# EAGLE design main (EAGLE 9.5.2)
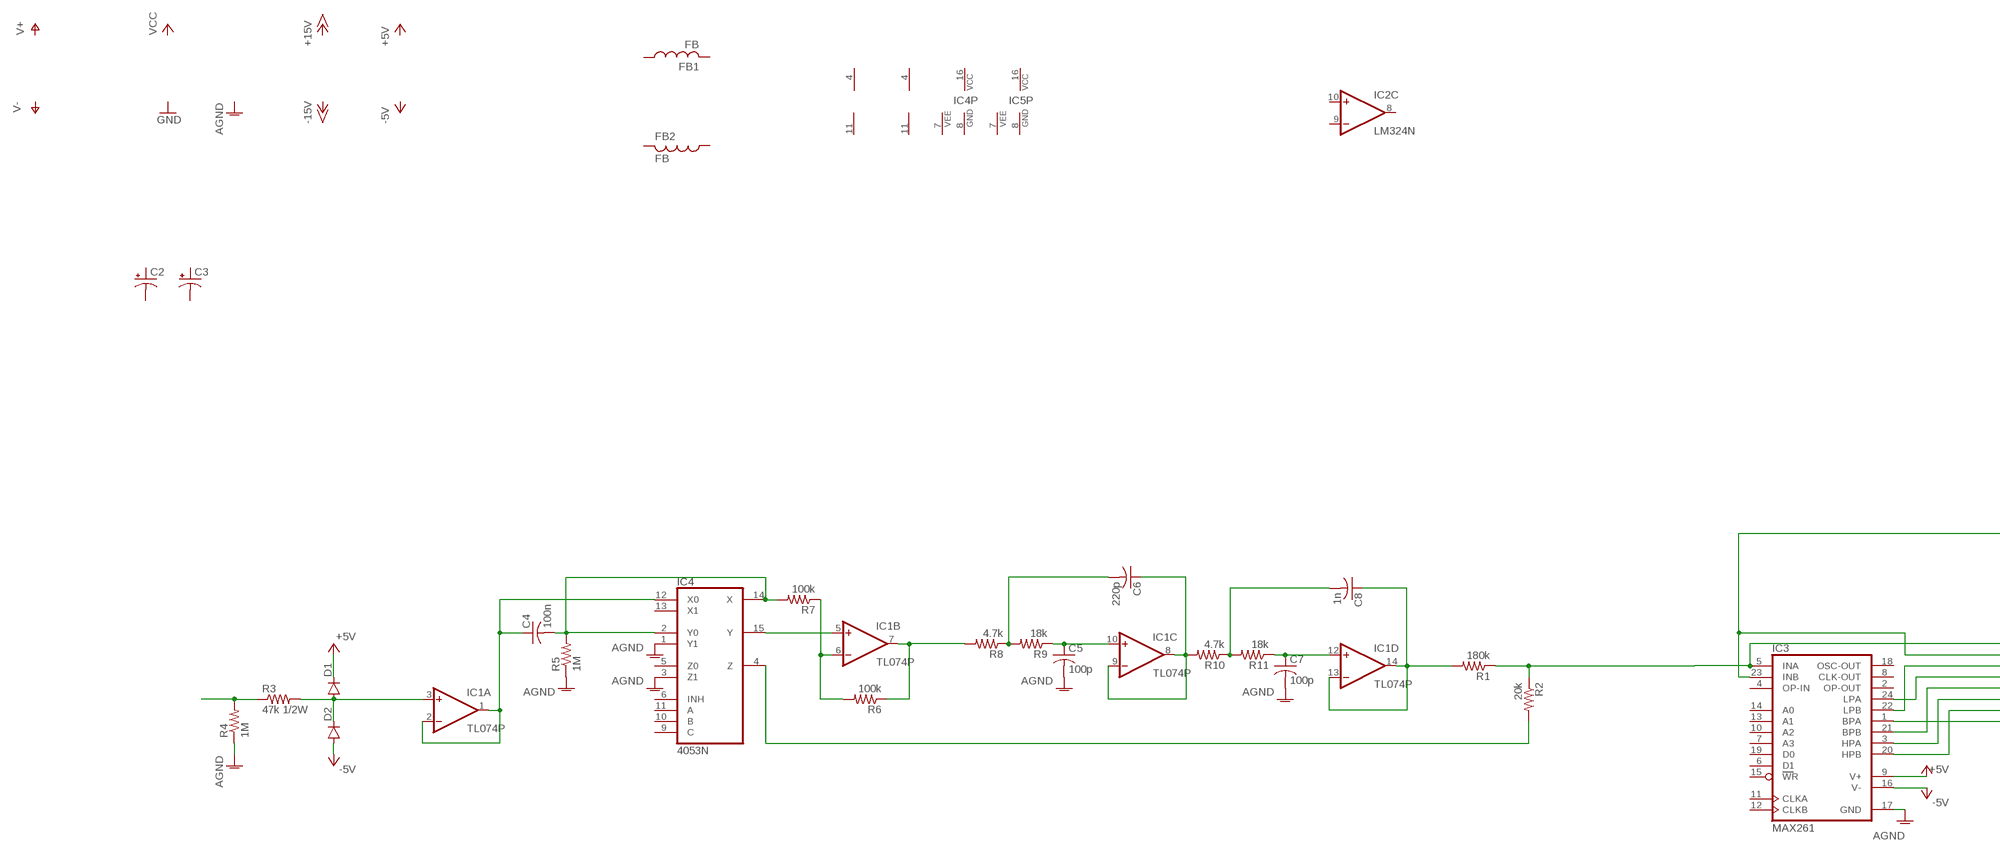
[diagram p0: schematic, sheet 1, part 1 of 2]
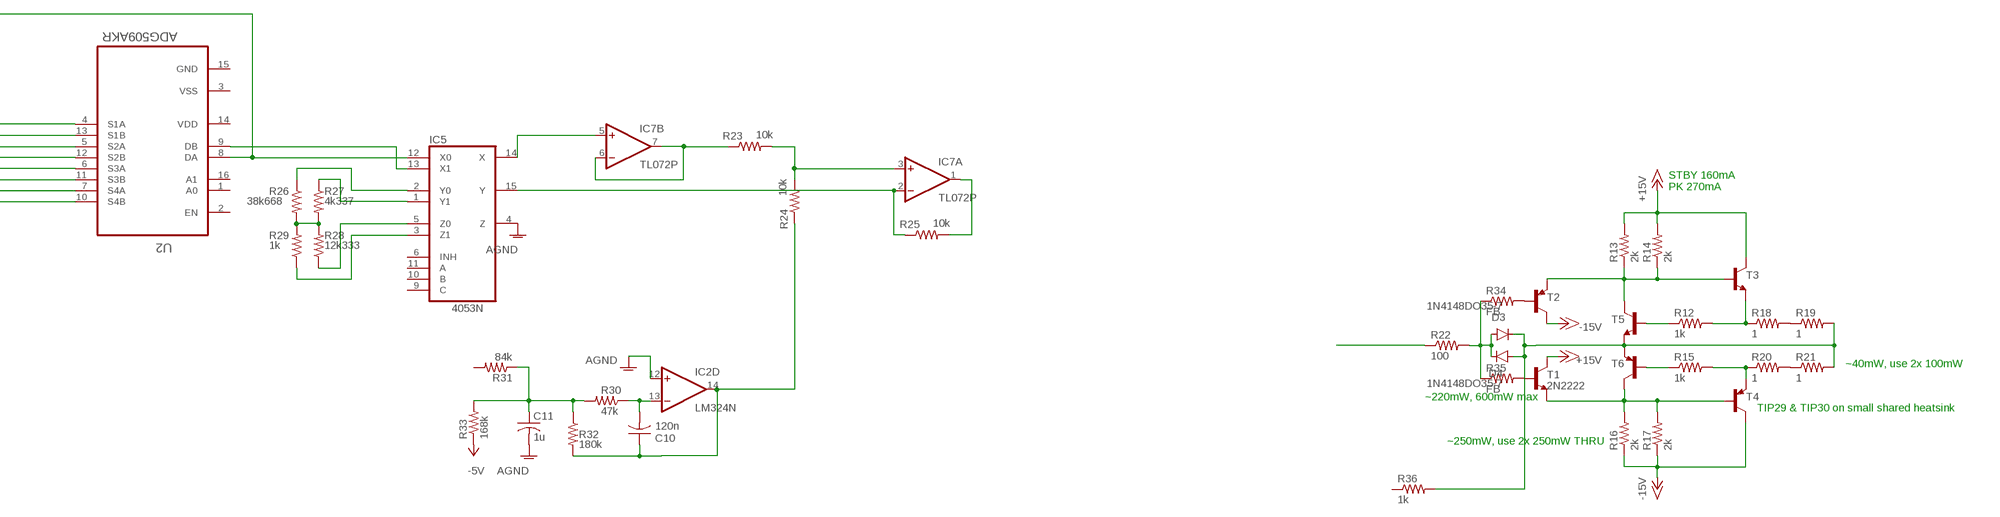
[diagram p1: schematic, sheet 1, part 2 of 2]

## Parts
C2  CPOL-USC/6032-28R  [C/6032-28R]
C3  CPOL-USE2.5-6  [E2,5-6]
C4  100n  C-USC0603  [C0603]
C5  100p  C-USC0603  [C0603]
C6  220p  C-USC0603  [C0603]
C7  100p  C-USC0603  [C0603]
C8  1n  C-USC0603  [C0603]
C10  120n  C-USC0603  [C0603]
C11  1u  C-USC0603  [C0603]
D1  1N4148DO35-10  [DO35-10]
D2  1N4148DO35-10  [DO35-10]
D3  1N4148DO35-7  [DO35-7]
D4  1N4148DO35-7  [DO35-7]
FB1  FB  [FB]
FB2  FB  [FB]
IC1  TL074P  [DIL14]
IC2  LM324N  [DIL14]
IC3  MAX261  [DIL24-3]
IC4  4053N  [DIL16]
IC5  4053N  [DIL16]
IC7  TL072P  [DIL08]
R1  180k  R-US_R0603  [R0603]
R2  20k  R-US_R0603  [R0603]
R3  47k 1/2W  R-US_0207/10  [0207/10]
R4  1M  R-US_0207/10  [0207/10]
R5  1M  R-US_R0603  [R0603]
R6  100k  R-US_R0603  [R0603]
R7  100k  R-US_R0603  [R0603]
R8  4.7k  R-US_R0603  [R0603]
R9  18k  R-US_R0603  [R0603]
R10  4.7k  R-US_R0603  [R0603]
R11  18k  R-US_R0603  [R0603]
R12  1k  R-US_0207/7  [0207/7]
R13  2k  R-US_0207/2V  [0207/2V]
R14  2k  R-US_0207/2V  [0207/2V]
R15  1k  R-US_0207/7  [0207/7]
R16  2k  R-US_0207/2V  [0207/2V]
R17  2k  R-US_0207/2V  [0207/2V]
R18  1  R-US_R0805  [R0805]
R19  1  R-US_R0805  [R0805]
R20  1  R-US_R0805  [R0805]
R21  1  R-US_R0805  [R0805]
R22  100  R-US_0207/7  [0207/7]
R23  10k  R-US_R0603  [R0603]
R24  10k  R-US_R0603  [R0603]
R25  10k  R-US_R0603  [R0603]
R26  38k668  R-US_R0603  [R0603]
R27  4k337  R-US_R0603  [R0603]
R28  12k333  R-US_R0603  [R0603]
R29  1k  R-US_R0603  [R0603]
R30  47k  R-US_R0603  [R0603]
R31  84k  R-US_R0603  [R0603]
R32  180k  R-US_R0603  [R0603]
R33  168k  R-US_R0603  [R0603]
R34  FB  R-US_0207/7  [0207/7]
R35  FB  R-US_0207/7  [0207/7]
R36  1k  R-US_0207/7  [0207/7]
T1  2N2222  [TO92-EBC-OVAL]
T2  BC557A-PNP-TO92-EBC  [TO92-EBC]
T3  -NPN-TO220V  [TO220V]
T4  -PNP-TO220V  [TO220V]
T5  MMBT3904LT1-NPN-SOT23-BEC  [SOT23-BEC]
T6  MMBT3906LT1-PNP-SOT23-BEC  [SOT23-BEC]
U2  ADG509AKR  [SOIC127P600X175-16N]

## Nets
+5V: D1.C IC3.9(V+)
+15V: R13.2 R14.2 T1.C T3.2(C)
-5V: D2.A IC3.16(V-) R33.1
-15V: R16.1 R17.1 T2.C T4.2(C)
AGND: C5.2 C7.2 C11.2 IC2.12(D:+IN) IC3.17(GND) IC4.1(Y1) IC4.3(Z1) IC5.4(Z) R4.1 R5.1
N$1: D1.A D2.C IC1.3(A:+IN) R3.2
N$2: IC3.24(LPA) U2.12(S2B)
N$3: R3.1 R4.2
N$4: IC1.5(B:+IN) IC4.15(Y)
N$5: IC1.6(B:-IN) R6.2 R7.1
N$6: C4.2 IC4.2(Y0) IC4.14(X) R5.2 R7.2
N$7: C6.1 IC1.8(C:OUT) IC1.9(C:-IN) R10.2
N$8: IC1.7(B:OUT) R6.1 R8.2
N$9: C6.2 R8.1 R9.2
N$10: C5.1 IC1.10(C:+IN) R9.1
N$11: C8.1 IC1.13(D:-IN) IC1.14(D:OUT) R1.2
N$12: IC5.14(X) IC7.5(B:+IN)
N$13: C8.2 R10.1 R11.2
N$14: C7.1 IC1.12(D:+IN) R11.1
N$15: IC3.3(HPA) U2.11(S3B)
N$16: IC3.1(BPA) U2.10(S4B)
N$17: C4.1 IC1.1(A:OUT) IC1.2(A:-IN) IC4.12(X0)
N$18: IC3.22(LPB) U2.5(S2A)
N$19: IC3.21(BPB) U2.6(S3A)
N$20: IC3.20(HPB) U2.7(S4A)
N$21: IC3.5(INA) R1.1 R2.1 U2.4(S1A)
N$22: IC4.4(Z) R2.2
N$23: IC7.6(B:-IN) IC7.7(B:OUT) R23.1
N$24: D3.C D4.A R19.2 R21.2 R36.2 T5.E T6.E
N$25: R16.2 R17.2 T1.E T4.1(B) T6.C
N$26: R15.1 T6.B
N$27: R15.2 R20.1 T4.3(E)
N$28: R12.1 T5.B
N$29: R12.2 R18.1 T3.3(E)
N$30: R13.1 R14.1 T2.E T3.1(B) T5.C
N$31: IC3.23(INB) IC5.12(X0) U2.8(DA) U2.13(S1B)
N$32: R18.2 R19.1
N$33: R20.2 R21.1
N$34: R22.1
N$35: IC5.13(X1) U2.9(DB)
N$36: R35.2 T1.B
N$37: IC7.3(A:+IN) R23.2 R24.2
N$38: IC5.2(Y0) R26.1
N$39: IC5.1(Y1) R27.1
N$40: IC5.5(Z0) R28.1
N$41: IC5.3(Z1) R29.1
N$42: IC5.15(Y) IC7.2(A:-IN) R25.1
N$43: R26.2 R27.2 R28.2 R29.2
N$44: IC7.1(A:OUT) R25.2
N$45: C10.1 IC2.14(D:OUT) R24.1 R32.2
N$46: C10.2 IC2.13(D:-IN) R30.1
N$47: C11.1 R30.2 R31.1 R32.1 R33.2
N$48: D3.A D4.C R22.2 R34.1 R35.1
N$49: R34.2 T2.B
Unconnected: C2.+ C2.- C3.+ C3.- FB1.P$1 FB1.P$2 FB2.P$1 FB2.P$2 IC2.1(A:OUT) IC2.2(A:-IN) IC2.3(A:+IN) IC2.5(B:+IN) IC2.6(B:-IN) IC2.7(B:OUT) IC2.8(C:OUT) IC2.9(C:-IN) IC2.10(C:+IN) IC3.2(OP-OUT) IC3.4(OP-IN) IC3.6(D1) IC3.7(A3) IC3.8(CLK-OUT) IC3.10(A2) IC3.11(CLKA) IC3.12(CLKB) IC3.13(A1) IC3.14(A0) IC3.15(WR) IC3.18(OSC-OUT) IC3.19(D0) IC4.5(Z0) IC4.6(INH) IC4.9(C) IC4.10(B) IC4.11(A) IC4.13(X1) IC5.6(INH) IC5.9(C) IC5.10(B) IC5.11(A) R31.2 R36.1 U2.1(A0) U2.2(EN) U2.15(GND) U2.16(A1)

## Notes on the sheet
- STBY 160mA
  PK 270mA
- ~40mW, use 2x 100mW
- ~220mW, 600mW max
- TIP29 & TIP30 on small shared heatsink
- ~250mW, use 2x 250mW THRU

## Power pins joined to a net without a drawn wire
GND: IC4.8(GND) IC5.8(GND)
V+: IC1.4(P:V+) IC2.4(P:V+) IC7.8(P:V+)
V-: IC1.11(P:V-) IC2.11(P:V-) IC7.4(P:V-)
VCC: IC4.16(VCC) IC5.16(VCC)
VDD: U2.14(VDD)
VEE: IC4.7(VEE) IC5.7(VEE)
VSS: U2.3(VSS)

## Library data of the parts
C2 C3 = rcl:CPOL-US: POLARIZED CAPACITOR, American symbol; SPICEPREFIX: C
C4-C8 C10 C11 = rcl:C-US: CAPACITOR, American symbol; SPICEPREFIX: C
D1-D4 = diode:1N4148: DIODE high speed (Philips)
FB1 FB2 = adafruit:FB: Ferrite bead Digikey #P9821BK-ND
IC1 = linear:TL074: OP AMP
IC2 = linear:LM324: OP AMP
IC3 = maxim:MAX261: Switched-capacitor FILTER; MPN: MAX261BCNG+; OC_FARNELL: unknown; OC_NEWARK: 89K3470
IC4 IC5 = 40xx:4053: Triple 2-channel ANALOG MULTIPLEXER
IC7 = linear:TL072: OP AMP
R1-R11 R23-R33 = rcl:R-US_: RESISTOR, American symbol; SPICEPREFIX: R
R12-R22 R34-R36 = resistor:R-US_: RESISTOR, American symbol
T1 = adafruit:2N2222: NPN TRANSISTOR Big oval pads
T2 T4 = DC_LOAD_AU:*-PNP-: PNP Transistror
T3 = DC_LOAD_AU:*-NPN-: NPN Transistror BF959 corrected 2008.03.06
T5 = transistor:*-NPN-: NPN Transistror BF959 corrected 2008.03.06
T6 = transistor:*-PNP-: PNP Transistror
U2 = ADI-Phase-2:ADG509AKR: CMOS 4-Channel Analog Multiplexer; MPN: ADG509AKR; OC_FARNELL: unknown; OC_NEWARK: 05F6226; PACKAGE: SOIC_N-16; SUPPLIER: Analog Devices

## Board
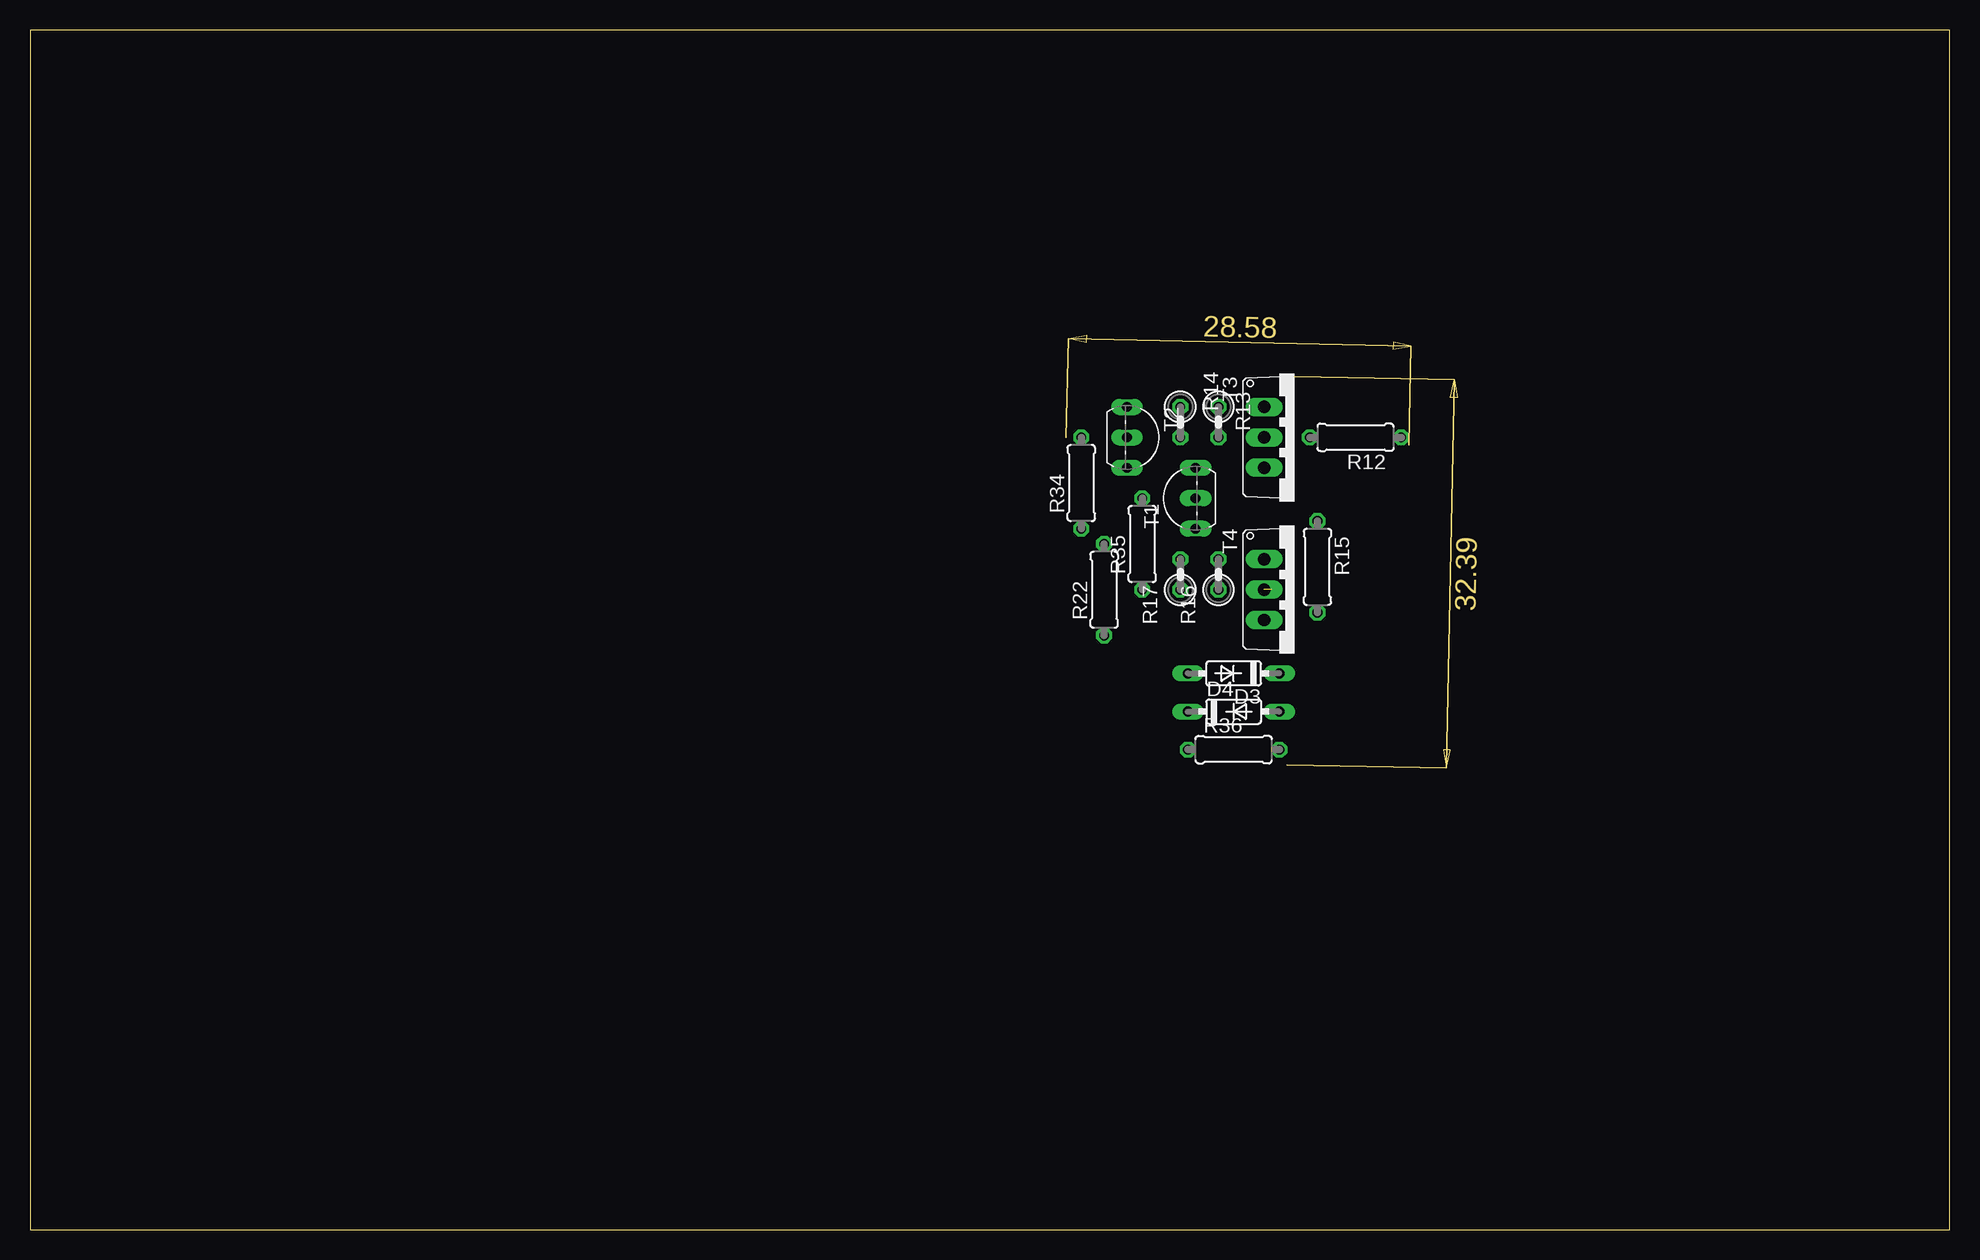
[diagram p2: board, top side]
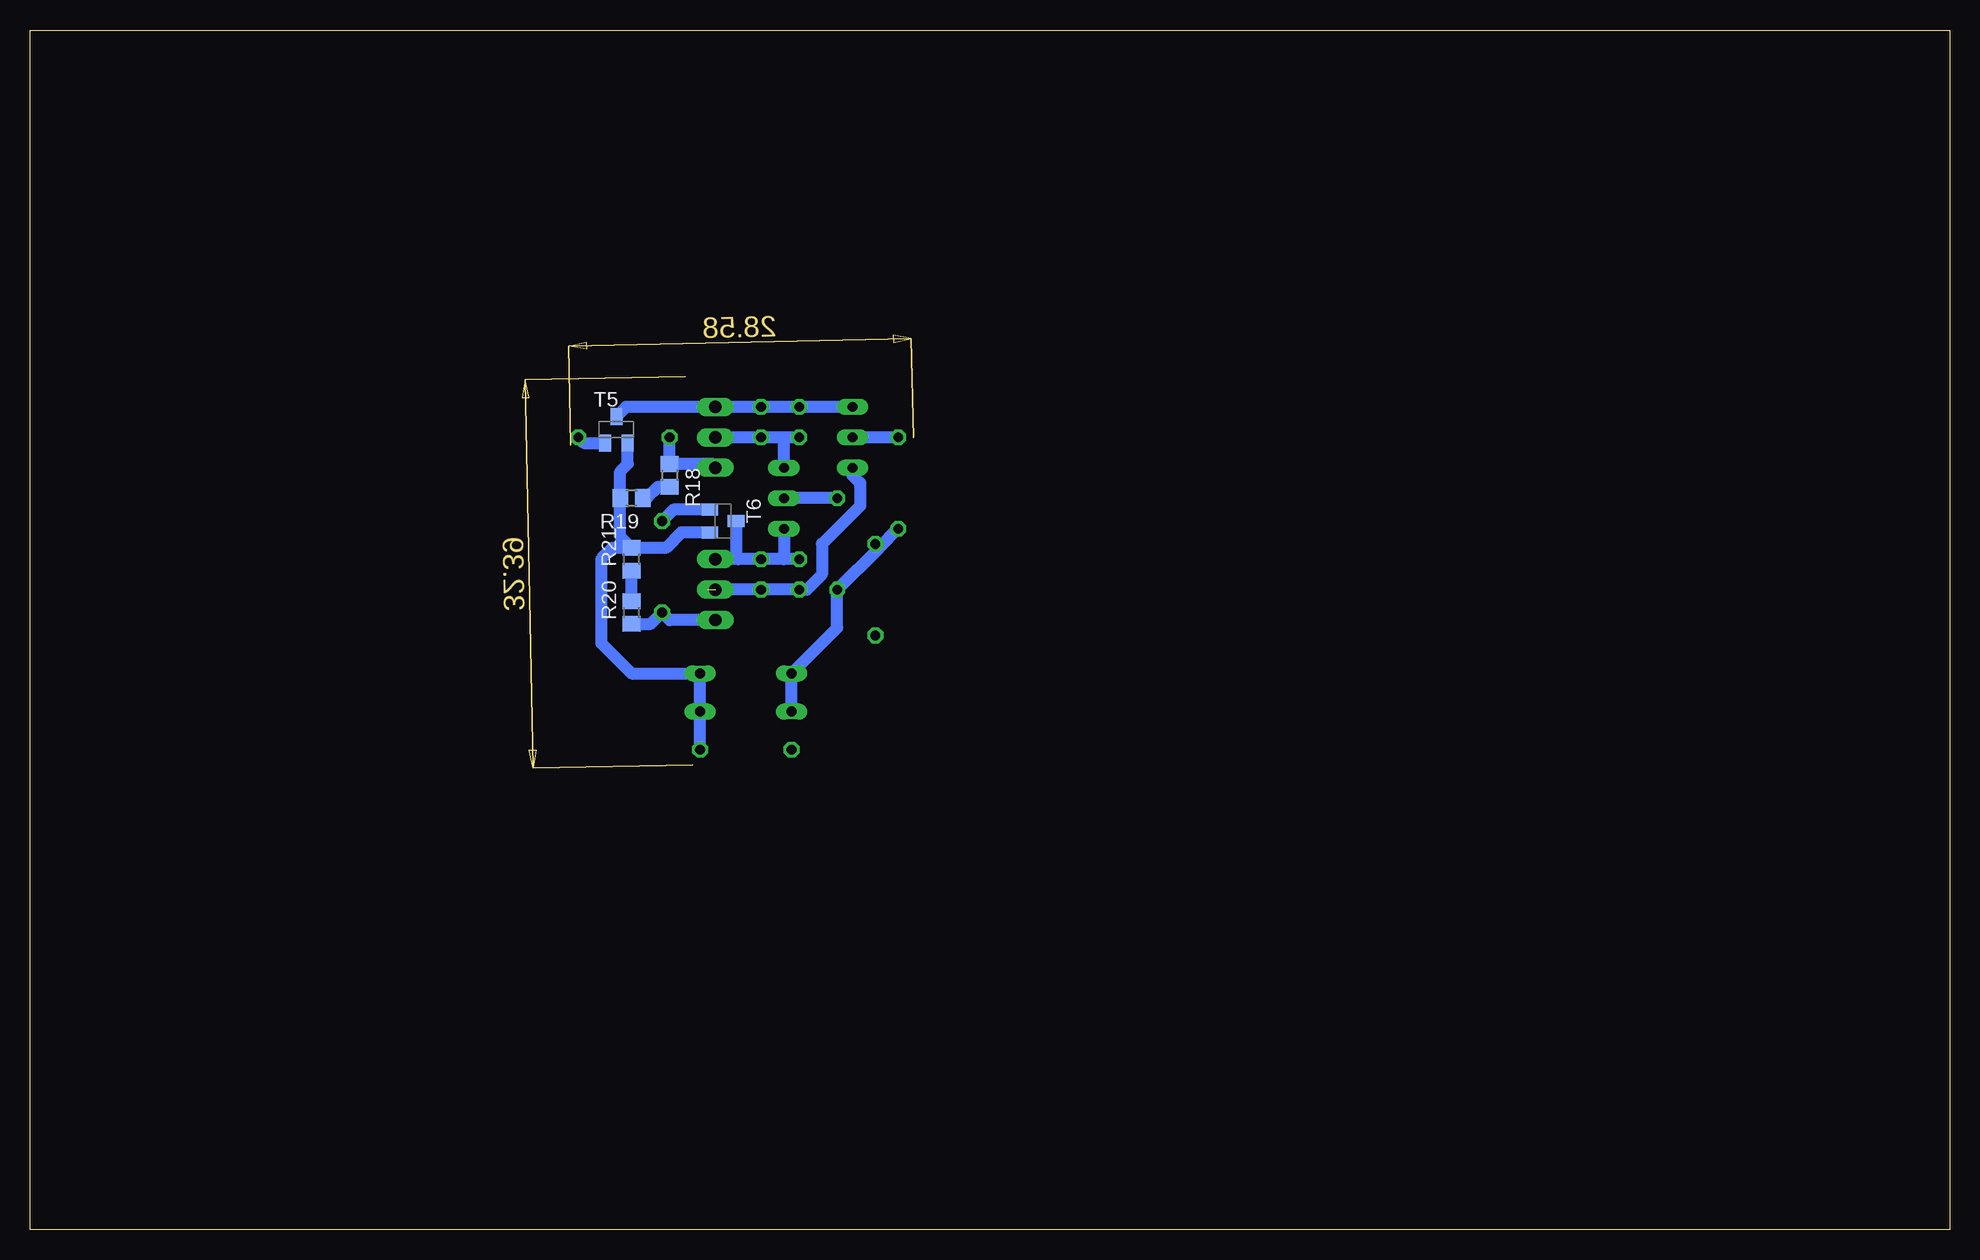
[diagram p3: board, bottom side, seen from below]

Size 160 x 100 mm. Coordinates in mm from the lower left corner, seen from the top.
Outline: 0,0 160,0 160,100 0,100 0,0
Copper layers (1*16): Top 0.035mm / dielectric 1.5mm / Bottom 0.035mm
Design rules "default": minimum track width 6mil, minimum drill 0.35mm, track to track 6mil, track to pad 6mil, pad to pad 6mil, via to via 6mil, smd to smd 6mil, copper to edge 40mil, drill to drill 6mil, minimum pad ring 10mil, minimum via ring 8mil, stop-mask expansion 4mil, vias tented up to drill 0mil, thermal gap 10mil

### Footprints (pad centres in the part's own frame; a part is rotated, then mirrored left to right if it is on the bottom)
C/6032-28R = smd 2.55 x 2.5: + 2.525,0; - -2.525,0
E2,5-6 = drill 0.813 pad 1.6: + -1.27,0 | drill 0.813 pad 1.6 octagon: - 1.27,0
C0603 = smd 1.1 x 1: 1 -0.85,0; 2 0.85,0
DO35-10 = drill 0.813 long: A 5.08,0; C -5.08,0
DO35-7 = drill 0.813 long: A 3.81,0; C -3.81,0
FB = drill 0.8 pad 1.93: P$1 -2.5,0; P$2 2.5,0
DIL14 = drill 0.813 long: 1 -7.62,-3.81; 2 -5.08,-3.81; 3 -2.54,-3.81; 4 0,-3.81; 5 2.54,-3.81; 6 5.08,-3.81; 7 7.62,-3.81; 8 7.62,3.81; 9 5.08,3.81; 10 2.54,3.81; 11 0,3.81; 12 -2.54,3.81; 13 -5.08,3.81; 14 -7.62,3.81
DIL24-3 = drill 0.813 long: 1 -13.97,-3.81; 2 -11.43,-3.81; 3 -8.89,-3.81; 4 -6.35,-3.81; 5 -3.81,-3.81; 6 -1.27,-3.81; 7 1.27,-3.81; 8 3.81,-3.81; 9 6.35,-3.81; 10 8.89,-3.81; 11 11.43,-3.81; 12 13.97,-3.81; 13 13.97,3.81; 14 11.43,3.81; 15 8.89,3.81; 16 6.35,3.81; 17 3.81,3.81; 18 1.27,3.81; 19 -1.27,3.81; 20 -3.81,3.81; 21 -6.35,3.81; 22 -8.89,3.81; 23 -11.43,3.81; 24 -13.97,3.81
DIL16 = drill 0.813 long: 1 -8.89,-3.81; 2 -6.35,-3.81; 3 -3.81,-3.81; 4 -1.27,-3.81; 5 1.27,-3.81; 6 3.81,-3.81; 7 6.35,-3.81; 8 8.89,-3.81; 9 8.89,3.81; 10 6.35,3.81; 11 3.81,3.81; 12 1.27,3.81; 13 -1.27,3.81; 14 -3.81,3.81; 15 -6.35,3.81; 16 -8.89,3.81
DIL08 = drill 0.813 pad 1.27: 1 -3.81,-3.81; 2 -1.27,-3.81; 3 1.27,-3.81; 4 3.81,-3.81; 5 3.81,3.81; 6 1.27,3.81; 7 -1.27,3.81; 8 -3.81,3.81
R0603 = smd 1 x 1.1: 1 -0.85,0; 2 0.85,0
0207/10 = drill 0.813 octagon: 1 -5.08,0; 2 5.08,0
0207/7 = drill 0.813 octagon: 1 -3.81,0; 2 3.81,0
0207/2V = drill 0.813 octagon: 1 -1.27,0; 2 1.27,0
R0805 = smd 1.3 x 1.5: 1 -0.95,0; 2 0.95,0
TO92-EBC-OVAL = drill 0.813 long: B 0,-1.27; C 2.54,-1.27; E -2.54,-1.27
TO92-EBC = drill 0.813 long: B 0,-1.27; C 2.54,-1.27; E -2.54,-1.27
TO220V = drill 1.016 long: 1 -2.54,-2.54; 2 0,-2.54; 3 2.54,-2.54
SOT23-BEC = smd 1 x 1.4: B -0.95,-1.1; C 0,1.1; E 0.95,-1.1
SOIC127P600X175-16N = smd 2.184 x 0.559: 1 -2.362,4.445; 2 -2.362,3.175; 3 -2.362,1.905; 4 -2.362,0.635; 5 -2.362,-0.635; 6 -2.362,-1.905; 7 -2.362,-3.175; 8 -2.362,-4.445; 9 2.362,-4.445; 10 2.362,-3.175; 11 2.362,-1.905; 12 2.362,-0.635; 13 2.362,0.635; 14 2.362,1.905; 15 2.362,3.175; 16 2.362,4.445

### Placement (x,y rotation side)
C2  -17.78,67.31 0 top  (outside the outline)
C3  -35.56,62.23 0 top  (outside the outline)
C4  -48.26,68.58 0 top  (outside the outline)
C5  -54.61,68.58 0 top  (outside the outline)
C6  -60.96,68.58 0 top  (outside the outline)
C7  -67.31,68.58 0 top  (outside the outline)
C8  -45.72,78.74 0 top  (outside the outline)
C10  -73.66,68.58 0 top  (outside the outline)
C11  -21.59,78.74 0 top  (outside the outline)
D1  -25.4,55.88 0 top  (outside the outline)
D2  -44.45,55.88 0 top  (outside the outline)
D3  100.33,46.35 180 top
D4  100.33,43.18 0 top
FB1  -48.26,45.72 0 top  (outside the outline)
FB2  -57.15,45.72 0 top  (outside the outline)
IC1  -22.86,38.1 0 top  (outside the outline)
IC2  -43.18,38.1 0 top  (outside the outline)
IC3  -48.26,6.35 0 top  (outside the outline)
IC4  -24.13,26.67 0 top  (outside the outline)
IC5  -46.99,26.67 0 top  (outside the outline)
IC7  -59.69,36.83 0 top  (outside the outline)
R1  -16.51,73.66 0 top  (outside the outline)
R2  -31.75,78.74 0 top  (outside the outline)
R3  -53.34,77.47 0 top  (outside the outline)
R4  -66.04,77.47 0 top  (outside the outline)
R5  -41.91,78.74 0 top  (outside the outline)
R6  -22.86,73.66 0 top  (outside the outline)
R7  -29.21,73.66 0 top  (outside the outline)
R8  -46.99,73.66 0 top  (outside the outline)
R9  -36.83,78.74 0 top  (outside the outline)
R10  -52.07,73.66 0 top  (outside the outline)
R11  -26.67,78.74 0 top  (outside the outline)
R12  110.49,66.04 180 top
R13  99.06,67.31 270 top
R14  95.89,67.31 270 top
R15  107.31,55.24 270 top
R16  99.06,54.61 90 top
R17  95.89,54.61 90 top
R18  106.68,62.87 270 bottom
R19  109.86,60.96 180 bottom
R20  109.86,51.44 90 bottom
R21  109.86,55.88 90 bottom
R22  89.53,53.34 90 top
R23  -57.15,73.66 0 top  (outside the outline)
R24  -62.23,73.66 0 top  (outside the outline)
R25  -67.31,73.66 0 top  (outside the outline)
R26  -27.94,68.58 0 top  (outside the outline)
R27  -41.91,68.58 0 top  (outside the outline)
R28  -35.56,68.58 0 top  (outside the outline)
R29  -72.39,73.66 0 top  (outside the outline)
R30  -77.47,73.66 0 top  (outside the outline)
R31  -16.51,78.74 0 top  (outside the outline)
R32  -35.56,73.66 0 top  (outside the outline)
R33  -41.91,73.66 0 top  (outside the outline)
R34  87.63,62.23 90 top
R35  92.71,57.15 90 top
R36  100.33,40.01 0 top
T1  95.89,60.96 90 top
T2  92.71,66.04 270 top
T3  105.41,66.04 270 top
T4  105.41,53.34 270 top
T5  111.12,66.67 0 bottom
T6  102.23,59.05 270 bottom
U2  -27.94,10.16 0 top  (outside the outline)

### Tracks (layer width: path | path; a pad name or v marks a point on that pad's centre or on a via)
+5V  (1 unrouted)
+15V
  Bottom 1.016: R14.2 97.16,66.04 | 97.16,66.04 R13.2 T3.2 | T1.C 97.16,66.04
-5V  (2 unrouted)
-15V  (1 unrouted)
  Bottom 1.016: 103.5,53.34 R16.1 R17.1 95.25,53.34 93.98,54.61 93.98,57.15 90.81,60.33 90.81,62.23 91.44,62.87 T2.C
AGND  (9 unrouted)
GND  (1 unrouted)
N$1  (3 unrouted)
N$2  (1 unrouted)
N$3  (1 unrouted)
N$4  (1 unrouted)
N$5  (2 unrouted)
N$6  (4 unrouted)
N$7  (3 unrouted)
N$8  (2 unrouted)
N$9  (2 unrouted)
N$10  (2 unrouted)
N$11  (3 unrouted)
N$12  (1 unrouted)
N$13  (2 unrouted)
N$14  (2 unrouted)
N$15  (1 unrouted)
N$16  (1 unrouted)
N$17  (3 unrouted)
N$18  (1 unrouted)
N$19  (1 unrouted)
N$20  (1 unrouted)
N$21  (3 unrouted)
N$22  (1 unrouted)
N$23  (2 unrouted)
N$24
  Bottom 1.016: T6.E 105.72,58.1 107,56.83 R21.2 | R21.2 110.81,57.78 R19.2 110.81,63.19 110.17,63.81 T5.E | R36.2 D4.A D3.C 109.86,46.35 112.39,48.9 112.39,55.88 111.44,56.83 R21.2
N$25
  Bottom 1.016: R17.2 97.16,55.88 | 97.16,55.88 R16.2 100.97,55.88 | 100.97,55.88 T4.1 | T1.E 97.16,55.88 | T6.C 101.14,56.05 100.97,55.88
N$26
  Bottom 1.016: T6.B 106.36,60.01 R15.1
N$27
  Bottom 1.016: T4.3 106.68,50.8 R15.2 108.27,50.48 R20.1
N$28
  Bottom 1.016: R12.1 113.83,65.58 T5.B
N$29
  Bottom 1.016: R12.2 R18.1 103.19,63.81 T3.3
N$30
  Bottom 1.016: T2.E R14.1 R13.1 T3.1 110.32,68.58 T5.C
N$31  (3 unrouted)
N$32
  Bottom 1.016: R18.2 107.63,61.91 108.58,60.96 R19.1
N$33
  Bottom 1.016: R20.2 R21.1
N$35  (1 unrouted)
N$36
  Bottom 1.016: R35.2 T1.B
N$37  (2 unrouted)
N$38  (1 unrouted)
N$39  (1 unrouted)
N$40  (1 unrouted)
N$41  (1 unrouted)
N$42  (2 unrouted)
N$43  (3 unrouted)
N$44  (1 unrouted)
N$45  (3 unrouted)
N$46  (2 unrouted)
N$47  (4 unrouted)
N$48
  Bottom 1.016: D4.C D3.A 92.71,50.16 R35.1 89.22,56.83 | 89.22,56.83 R34.1 | R22.2 89.22,56.83
N$49
  Bottom 1.016: R34.2 T2.B
V+  (2 unrouted)
V-  (2 unrouted)
VCC  (1 unrouted)
VEE  (1 unrouted)